# Altium schematic sheet Buck converter. Page 2.SchDoc
size 420 x 297 mm; Address1: Address1; Address2: Address2; Address3: Address3; Address4: Address4; DocumentNumber: АБВГ.123456.001 Э3; SheetNumber: 2; SheetTotal: 4; Scale: 1:1; DocumentType: Схема электрическая принципиальная; FirstReferrence: АБВГ.123456.001
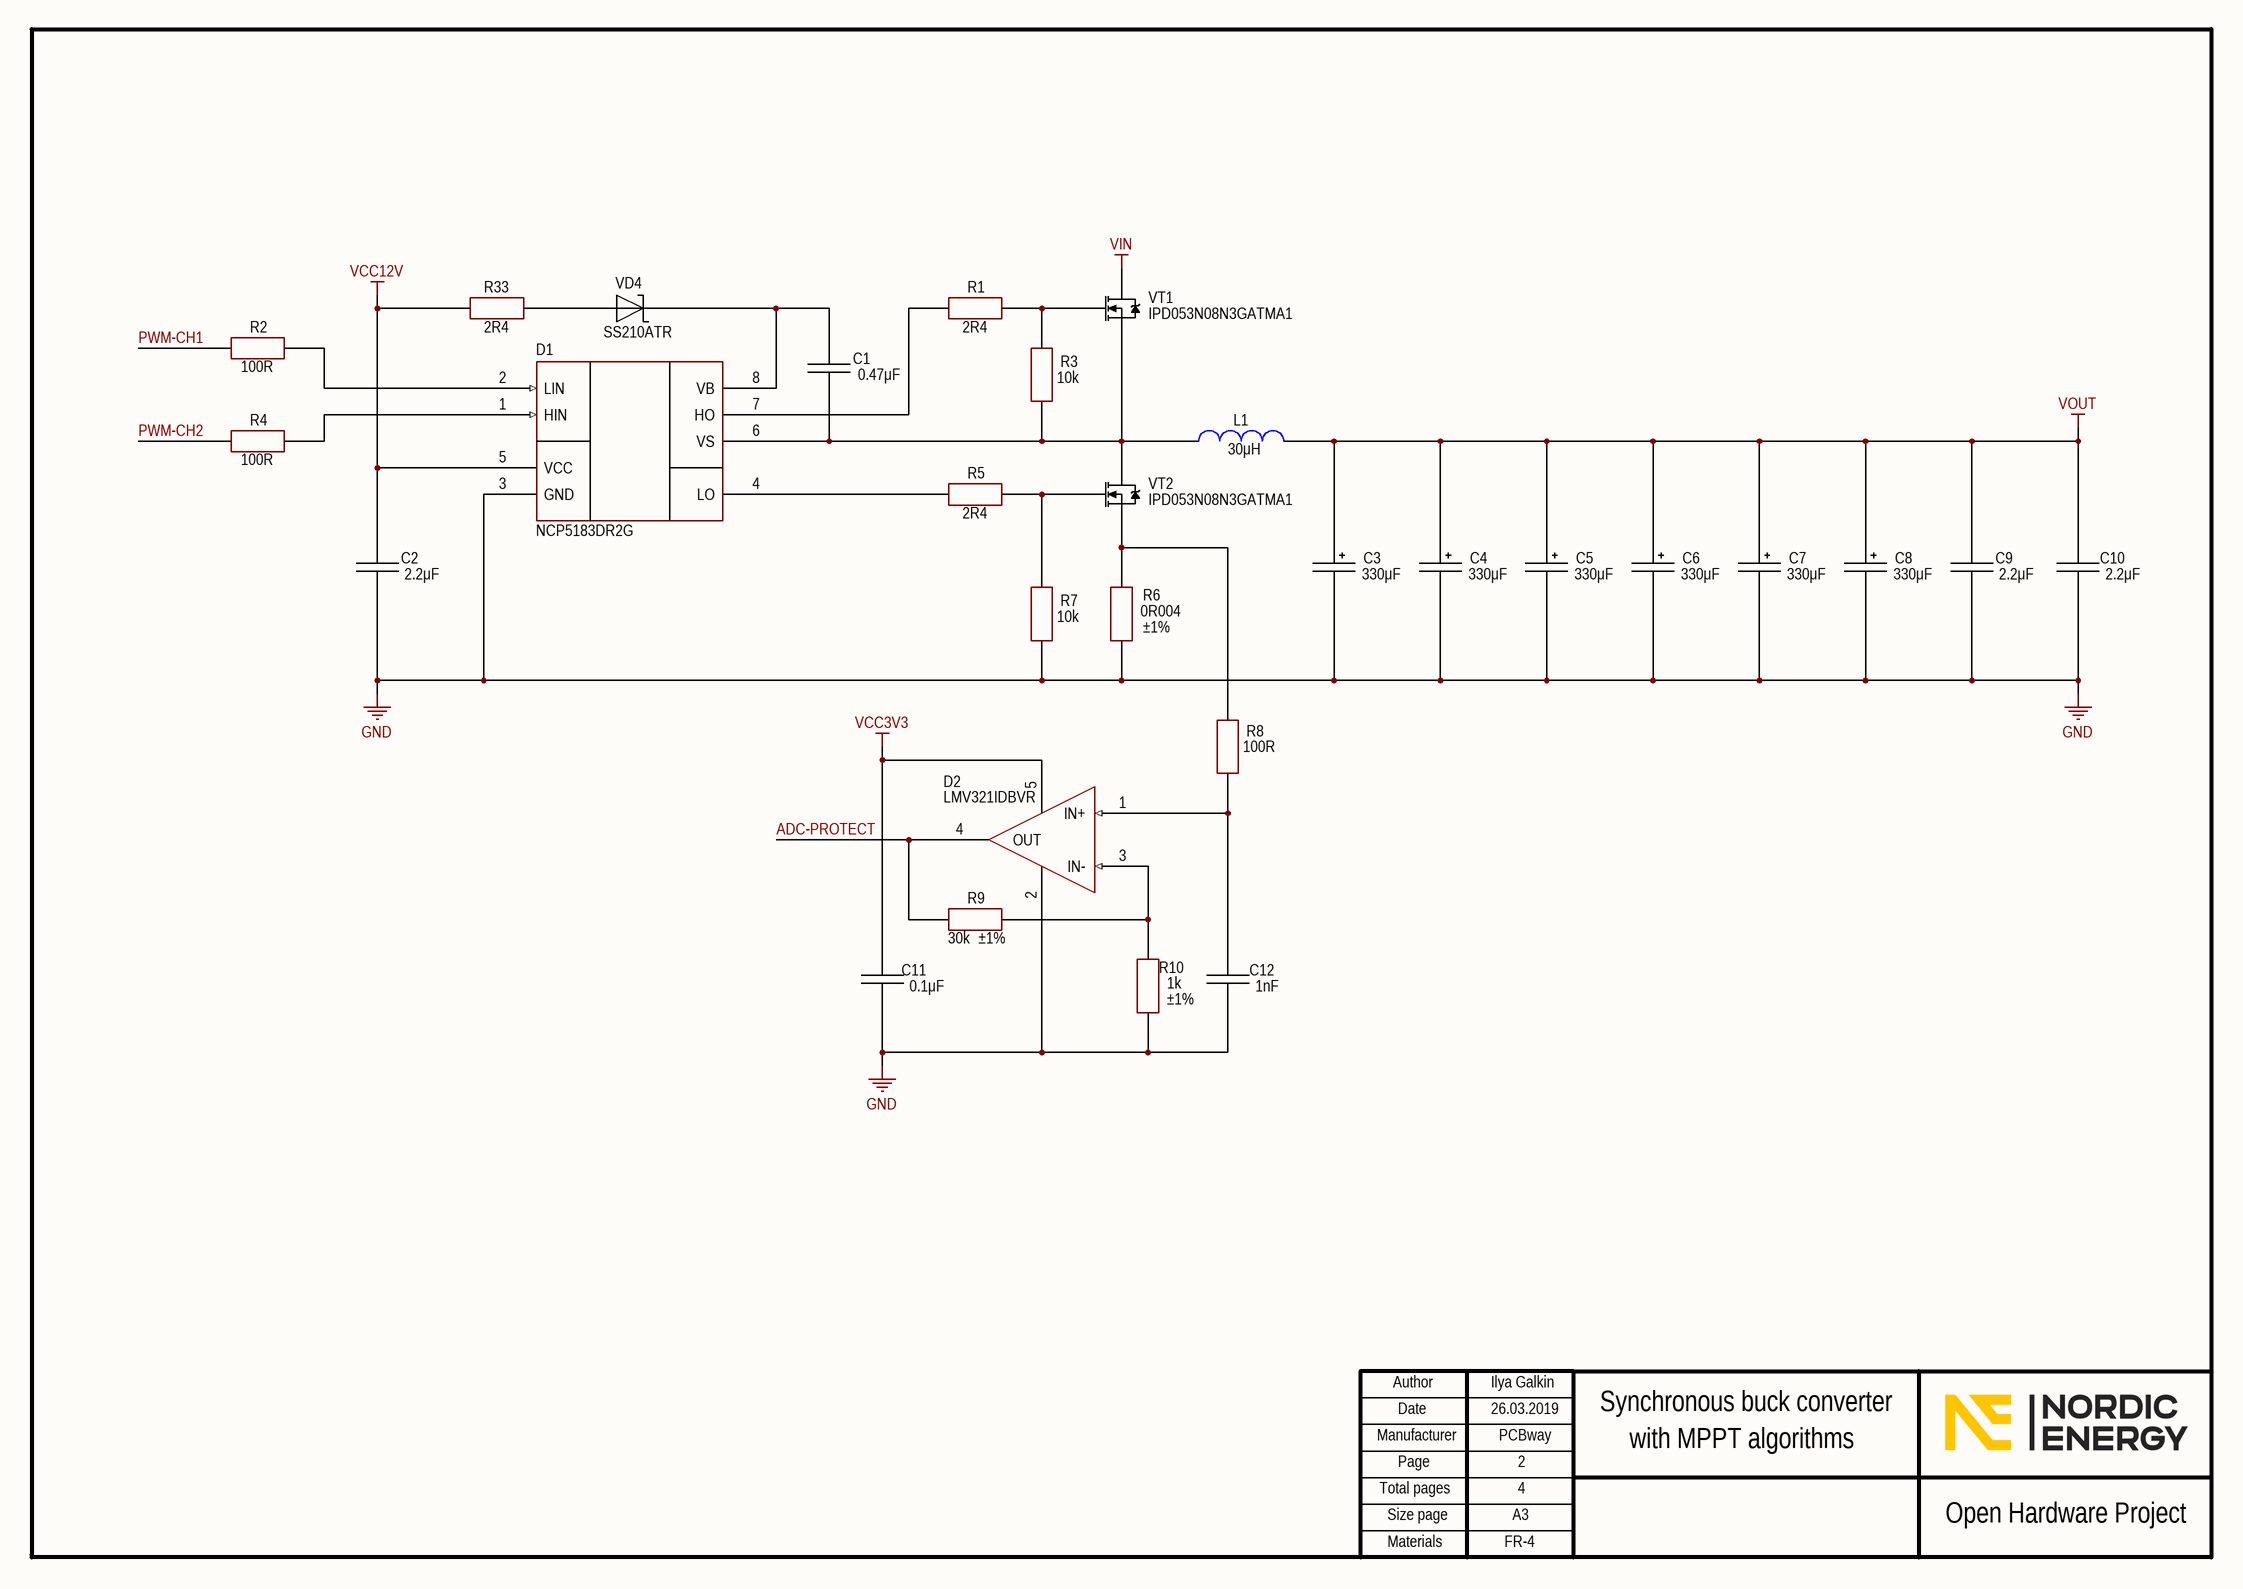
[diagram p0: Buck converter. Page 2.SchDoc]

## Parts
C1  0.47μF  [CH1206C]
C2  2.2μF  [CH1206C]
C3  330μF  [D10C5H12.5]
C4  330μF  [D10C5H12.5]
C5  330μF  [D10C5H12.5]
C6  330μF  [D10C5H12.5]
C7  330μF  [D10C5H12.5]
C8  330μF  [D10C5H12.5]
C9  2.2μF  [CH1206C]
C10  2.2μF  [CH1206C]
C11  0.1μF  [CH0805C]
C12  1nF  [CH0805C]
D1  NCP5183DR2G  [8-SOIC]
D2  LMV321IDBVR  [SOT23-5]
L1  30μH  [IND: R32.8/20.1/10.7 (L)]
R1  2R4  [CH0805R]
R2  100R  [CH0805R]
R3  10k  [CH0805R]
R4  100R  [CH0805R]
R5  2R4  [CH0805R]
R6  0R004  ComponentKind: ±1%  [CH2512R]
R7  10k  [CH0805R]
R8  100R  [CH0805R]
R9  30k  ComponentKind: ±1%  [CH0805R]
R10  1k  ComponentKind: ±1%  [CH0805R]
R33  2R4  [CH0805R]
VD4  SS210ATR  [SMA]
VT1  IPD053N08N3GATMA1  [D2PAK]
VT2  IPD053N08N3GATMA1  [D2PAK]

## Nets
GND: C2.1 C3.2 C4.2 C5.2 C6.2 C7.2 C8.2 C9.1 C10.1 C11.1 C12.1 D1.3(GND) D2.2(V-) R6.2 R7.1 R10.2
VCC3V3: C11.2 D2.5(V+)
VCC12V: C2.2 D1.5(VCC) R33.2
VIN: VT1.2(D)
VOUT: C3.1 C4.1 C5.1 C6.1 C7.1 C8.1 C9.2 C10.2 L1.1
ADC-PROTECT: D2.4(OUT) R9.2
PWM-CH1: R2.1
PWM-CH2: R4.1
NetC1_1: C1.1 D1.6(VS) L1.2 R3.1 VT1.3(S) VT2.2(D)
NetC1_2: C1.2 D1.8(VB) VD4.2
NetC12_2: C12.2 D2.1(IN+) R8.2
NetD1_1: D1.1(HIN) R4.2
NetD1_2: D1.2(LIN) R2.2
NetD1_4: D1.4(LO) R5.2
NetD1_7: D1.7(HO) R1.2
NetD2_3: D2.3(IN-) R9.1 R10.1
NetR1_1: R1.1 R3.2 VT1.1(G)
NetR5_1: R5.1 R7.2 VT2.1(G)
NetR6_1: R6.1 R8.1 VT2.3(S)
NetR33_1: R33.1 VD4.1

## Notes on the sheet
- Ilya Galkin
- 26.03.2019
- PCBway
- 2
- Synchronous buck converter
- with MPPT algorithms
- 4
- FR-4
- Author
- Manufacturer
- Date
- Page
- Total pages
- Size page
- A3
- Open Hardware Project
- Materials

## Library data of the parts
C1 = Capacitor: Manufacturer: Yageo; Model: CC1206KRX7R8BB474; HelpURL: https://www.digikey.com/product-detail/en/yageo/CC1206KRX7R8BB474/311-3576-1-ND/7648503; ComponentKind: X7R; Value: 0.47μF
C2 C9 C10 = Capacitor: Manufacturer: Yageo; Model: CC1206KKX7R9BB225; HelpURL: https://www.digikey.com/product-detail/en/yageo/CC1206KKX7R9BB225/311-1964-1-ND/5195866; ComponentKind: X7R; Value: 2.2μF
C3-C8 = AlumCap: Manufacturer: Panasonic; Model: 35SEK330M; HelpURL: https://www.digikey.com/product-detail/en/panasonic-electronic-components/35SEK330M/P122629-ND/8030545; ComponentKind: 35V; Value: 330μF
C11 = Capacitor: Manufacturer: Yageo; Model: CC0805KRX7R8BB104; HelpURL: https://www.digikey.com/product-detail/en/yageo/CC0805KRX7R8BB104/311-1141-1-ND/303051; ComponentKind: X7R; Value: 0.1μF
C12 = Capacitor: Manufacturer: Yageo; Model: CC0805KRX7R9BB102; HelpURL: https://www.digikey.com/product-detail/en/yageo/CC0805KRX7R9BB102/311-1127-1-ND/303037; ComponentKind: X7R; Value: 1nF
D1 = NCP5183DR2G: Half-bridge; Manufacturer: ON Semiconductor; Model: NCP5183DR2G; HelpURL: https://www.digikey.com/product-detail/en/on-semiconductor/NCP5183DR2G/NCP5183DR2GOSCT-ND/7066807; ComponentKind: SO-8
D2 = LMV321IDBVR: Amplifer; Manufacturer: Texas Instruments; Model: LMV321IDBVR; ComponentKind: SOT-23-5; HelpURL: https://www.digikey.com/product-detail/en/texas-instruments/LMV321IDBVR/296-9567-1-ND/379849
L1 = Inductor ring: Manufacturer: Magnetics; Model: 0077071A7; Value: 30μH; ComponentKind: R32.8x20.1x10.7; HelpURL: http://ferrite.ru/warehouse/r-32-820-110-7-77071-a7.html
R1 R5 R33 = Resistor: Manufacturer: Yageo; Model: RC0805JR-072R4L; HelpURL: https://www.digikey.com/product-detail/en/yageo/RC0805JR-072R4L/311-2.4ARCT-ND/731220; ComponentKind: ±5%; Value: 2R4
R2 R4 R8 = Resistor: Manufacturer: Yageo; Model: RC0805JR-07100RL; HelpURL: https://www.digikey.com/product-detail/en/yageo/RC0805JR-07100RL/311-100ARCT-ND/731185; ComponentKind: ±5%; Value: 100R
R3 R7 = Resistor: Manufacturer: Yageo; Model: RC0805JR-0710KL; HelpURL: https://www.digikey.com/product-detail/en/yageo/RC0805JR-0710KL/311-10KARCT-ND/731188; ComponentKind: ±5%; Value: 10k
R6 = Resistor: Manufacturer: Yageo; Model: PA2512FKF7W0R004E; HelpURL: https://www.digikey.com/product-detail/en/yageo/PA2512FKF7W0R004E/YAG2144CT-ND/5139592; Value: 0R004
R9 = Resistor: Manufacturer: Yageo; Model: RC0805FR-0730KL; HelpURL: https://www.digikey.com/product-detail/en/yageo/RC0805FR-0730KL/311-30.0KCRCT-ND/730790; Value: 30k
R10 = Resistor: Manufacturer: Yageo; Model: RC0805FR-071KL; HelpURL: https://www.digikey.com/product-detail/en/yageo/RC0805FR-071KL/311-1.00KCRCT-ND/730391; Value: 1k
VD4 = Diod Schottky: Manufacturer: SMC Diode; ComponentKind: 100V 2A; Model: SS210ATR; HelpURL: https://www.digikey.com/product-detail/en/smc-diode-solutions/SS210ATR/1655-1896-1-ND/7914879
VT1 VT2 = N-chanel: Mosfet; Manufacturer: Infineon; Model: IPD053N08N3GATMA1; ComponentKind: 80V; HelpURL: https://www.digikey.com/product-detail/en/infineon-technologies/IPD053N08N3GATMA1/IPD053N08N3GATMA1CT-ND/5353500